# EAGLE schematic FrontboardTEST (EAGLE 9.0.1)
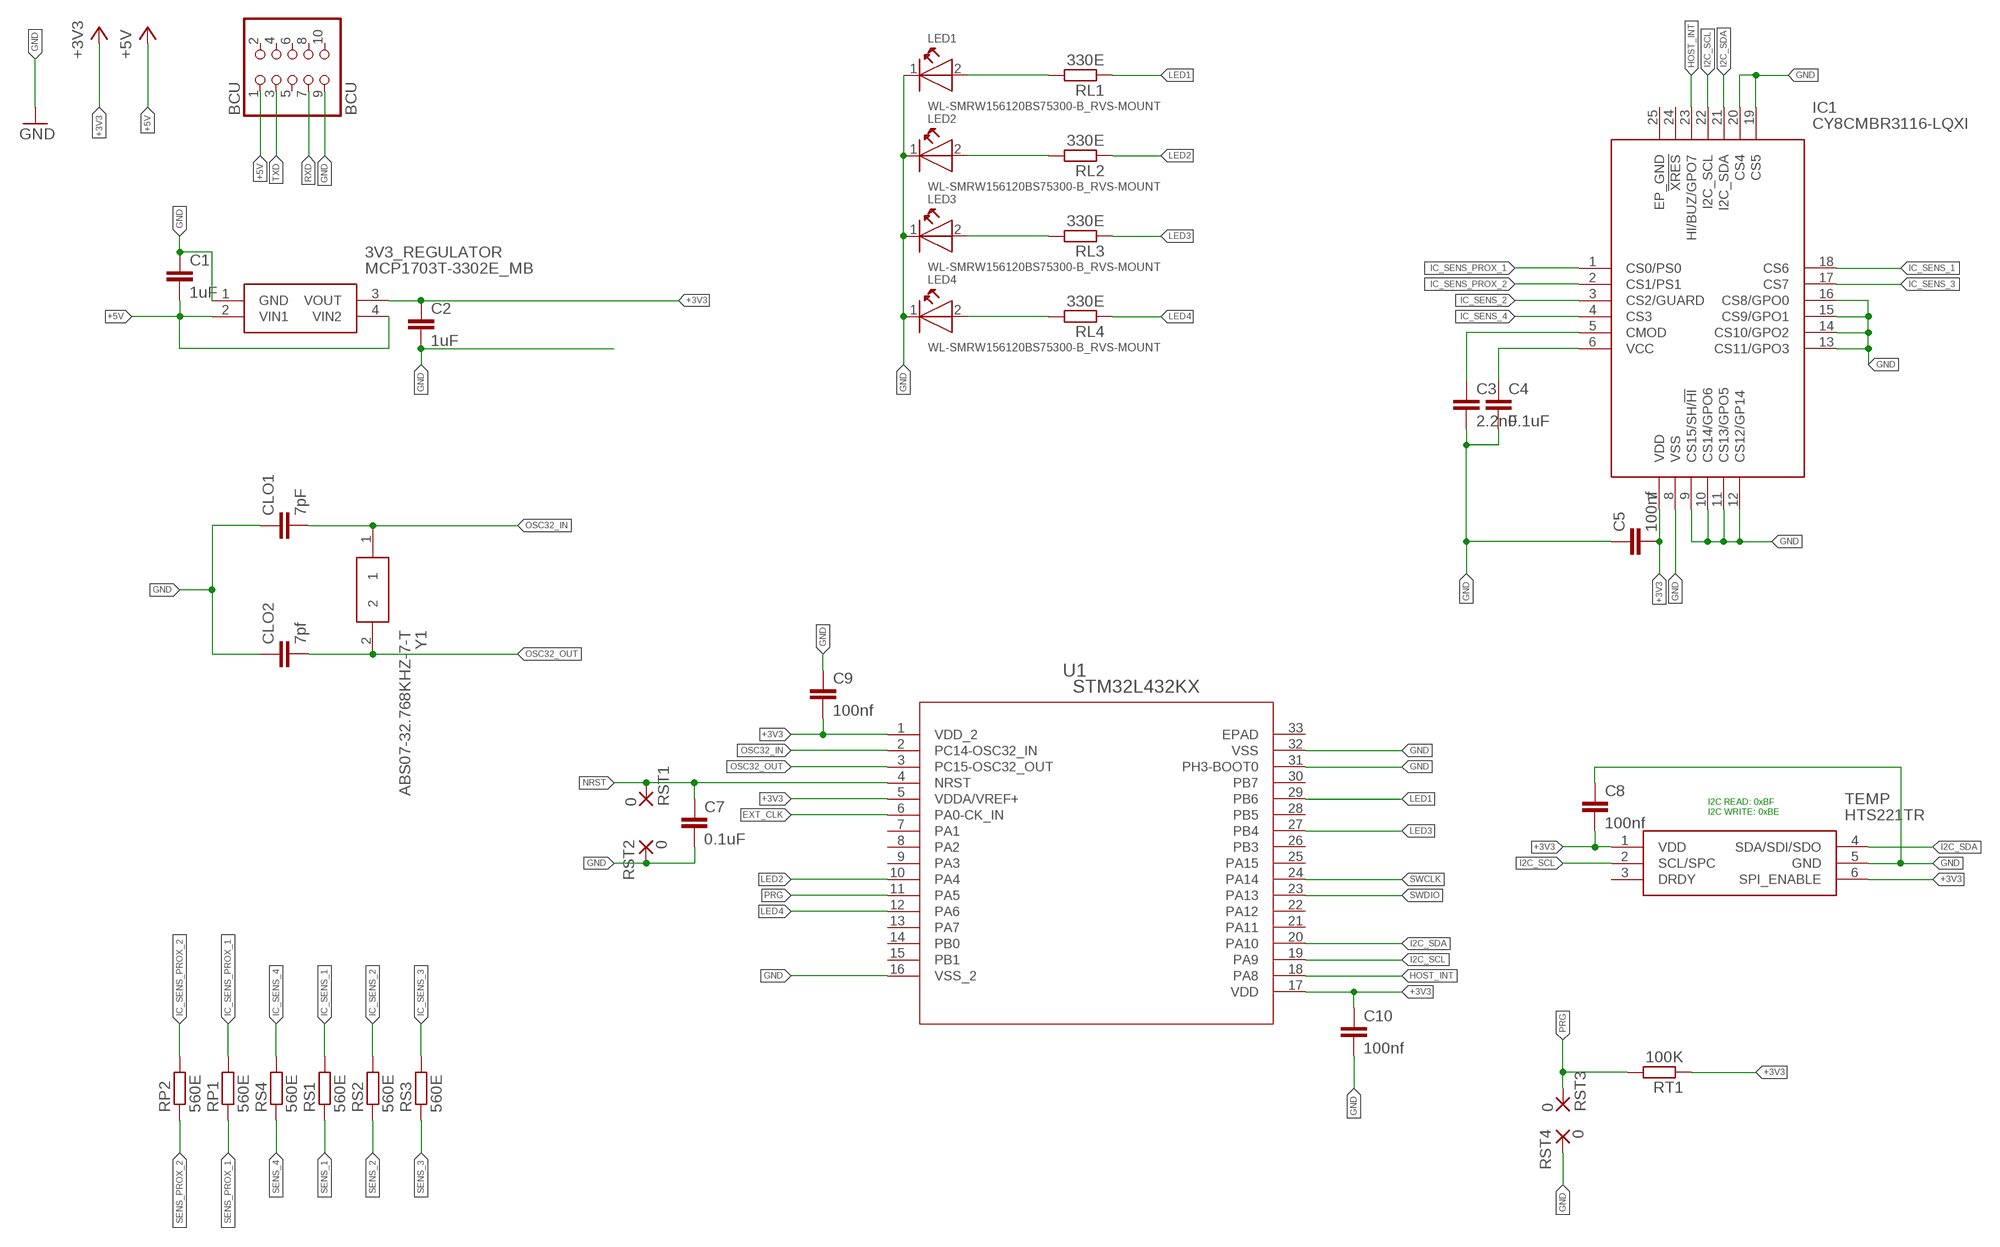
[diagram p0: schematic, sheet 1]

## Parts
3V3_REGULATOR  MCP1703T-3302E_MB  [SOT-89(MB)]
BCU  BCU  PINHD-2X5_2.54-SMD  [2X05SMD]
C1  1uF  C-EUC0603  [C0603]
C2  1uF  C-EUC0603  [C0603]
C3  2.2nF  C-EUC0603  [C0603]
C4  0.1uF  C-EUC0603  [C0603]
C5  100nf  C-EUC0603  [C0603]
C7  0.1uF  C-EUC0603  [C0603]
C8  100nf  C-EUC0603  [C0603]
C9  100nf  C-EUC0603  [C0603]
C10  100nf  C-EUC0603  [C0603]
CLO1  7pF  C-EUC0603  [C0603]
CLO2  7pf  C-EUC0603  [C0603]
IC1  CY8CMBR3116-LQXI  [QFN50P400X400X60-25N]
LED1  WL-SMRW156120BS75300-B_RVS-MOUNT  [WL-SMRW-1206-CYLDR-REVERSE-MOUNT]
LED2  WL-SMRW156120BS75300-B_RVS-MOUNT  [WL-SMRW-1206-CYLDR-REVERSE-MOUNT]
LED3  WL-SMRW156120BS75300-B_RVS-MOUNT  [WL-SMRW-1206-CYLDR-REVERSE-MOUNT]
LED4  WL-SMRW156120BS75300-B_RVS-MOUNT  [WL-SMRW-1206-CYLDR-REVERSE-MOUNT]
RL1  330E  R-EU_R0603  [R0603]
RL2  330E  R-EU_R0603  [R0603]
RL3  330E  R-EU_R0603  [R0603]
RL4  330E  R-EU_R0603  [R0603]
RP1  560E  R-EU_R0603  [R0603]
RP2  560E  R-EU_R0603  [R0603]
RS1  560E  R-EU_R0603  [R0603]
RS2  560E  R-EU_R0603  [R0603]
RS3  560E  R-EU_R0603  [R0603]
RS4  560E  R-EU_R0603  [R0603]
RST1  0  SMD5  [SMD2,54-5,08]
RST2  0  SMD5  [SMD2,54-5,08]
RST3  0  SMD5  [SMD2,54-5,08]
RST4  0  SMD5  [SMD2,54-5,08]
RT1  100K  R-EU_R0603  [R0603]
TEMP  HTS221TR  [HLGA-6L]
U1  STM32L432KX  [UFQFPN32-5X5MM]
Y1  ABS07-32.768KHZ-7-T  [ABS-07]

## Nets
+3V3: 3V3_REGULATOR.3(VOUT) C2.1 C5.2 C8.2 C9.2 C10.1 IC1.7(VDD) RT1.1 TEMP.1(VDD) TEMP.6(SPI_ENABLE) U1.1(VDD_2) U1.5(VDDA/VREF+) U1.17(VDD)
+5V: 3V3_REGULATOR.2(VIN1) 3V3_REGULATOR.4(VIN2) BCU.1 C1.2
CMOD: C3.1 IC1.5(CMOD)
EXT_CLK: U1.6(PA0-CK_IN)
GND: 3V3_REGULATOR.1(GND) BCU.9 C1.1 C2.2 C3.2 C4.2 C5.1 C7.2 C8.1 C9.1 C10.2 CLO1.1 CLO2.1 IC1.8(VSS) IC1.9(CS15/SH/!HI) IC1.10(CS14/GPO6) IC1.11(CS13/GPO5) IC1.12(CS12/GP14) IC1.13(CS11/GPO3) IC1.14(CS10/GPO2) IC1.15(CS9/GPO1) IC1.16(CS8/GPO0) IC1.19(CS5) IC1.20(CS4) LED1.1(K) LED2.1(K) LED3.1(K) LED4.1(K) RST2.1(P) RST4.1(P) TEMP.5(GND) U1.16(VSS_2) U1.31(PH3-BOOT0) U1.32(VSS)
HOST_INT: IC1.23(HI/BUZ/GPO7) U1.18(PA8)
I2C_SCL: IC1.22(I2C_SCL) TEMP.2(SCL/SPC) U1.19(PA9)
I2C_SDA: IC1.21(I2C_SDA) TEMP.4(SDA/SDI/SDO) U1.20(PA10)
IC_SENS_1: IC1.18(CS6) RS1.2
IC_SENS_2: IC1.3(CS2/GUARD) RS2.2
IC_SENS_3: IC1.17(CS7) RS3.2
IC_SENS_4: IC1.4(CS3) RS4.2
IC_SENS_PROX_1: IC1.1(CS0/PS0) RP1.2
IC_SENS_PROX_2: IC1.2(CS1/PS1) RP2.2
LED1: RL1.1 U1.29(PB6)
LED2: RL2.1 U1.10(PA4)
LED3: RL3.1 U1.27(PB4)
LED4: RL4.1 U1.12(PA6)
N$19: LED1.2(A) RL1.2
N$20: LED2.2(A) RL2.2
N$21: LED3.2(A) RL3.2
N$22: LED4.2(A) RL4.2
NRST: C7.1 RST1.1(P) U1.4(NRST)
OSC32_IN: CLO1.2 U1.2(PC14-OSC32_IN) Y1.1
OSC32_OUT: CLO2.2 U1.3(PC15-OSC32_OUT) Y1.2
PRG: RST3.1(P) RT1.2 U1.11(PA5)
RXD: BCU.7
SENS_1: RS1.1
SENS_2: RS2.1
SENS_3: RS3.1
SENS_4: RS4.1
SENS_PROX_1: RP1.1
SENS_PROX_2: RP2.1
SWCLK: U1.24(PA14)
SWDIO: U1.23(PA13)
TXD: BCU.3
VCC: C4.1 IC1.6(VCC)
Unconnected: BCU.2 BCU.4 BCU.5 BCU.6 BCU.8 BCU.10 IC1.24(!XRES) TEMP.3(DRDY) U1.7(PA1) U1.8(PA2) U1.9(PA3) U1.13(PA7) U1.14(PB0) U1.15(PB1) U1.21(PA11) U1.22(PA12) U1.25(PA15) U1.26(PB3) U1.28(PB5) U1.30(PB7) U1.33(EPAD)

## Notes on the sheet
- I2C READ: 0xBF
  I2C WRITE: 0xBE

## Power pins joined to a net without a drawn wire
EP_GND: IC1.25(EP_GND)

## Library data of the parts
3V3_REGULATOR = MCP1703T-3302E_MB:MCP1703T-3302E_MB: LDO Low Iq 250mA 16V 3.3V 2% SOT89 Microchip MCP1703T-3302E/MB, LDO Voltage Regulator, 250mA, 3.3 V 2%, 2.7 16 Vin, 3-Pin SOT-89 Source: Datasheet <http://ww1.microchip.com/downloads/en/DeviceDoc/22049f.pdf>; ALLIED_NUMBER: 70047986; ALLIED_PRICE/STOCK: https://www.alliedelec.com/microchip-technology-inc-mcp1703t-3302e-mb/70047986/; ARROW_PART_NUMBER: MCP1703T-3302E/MB; ARROW_PRICE/STOCK: https://www.arrow.com/en/products/mcp1703t-3302emb/microchip-technology; DESCRIPTION: LDO Low Iq 250mA 16V 3.3V 2% SOT89 Microchip MCP1703T-3302E/MB, LDO Voltage Regulator, 250mA, 3.3 V 2%, 2.7 16 Vin, 3-Pin SOT-89; HEIGHT: mm; MANUFACTURER_NAME: Microchip; MANUFACTURER_PART_NUMBER: MCP1703T-3302E/MB; RS_PART_NUMBER: 9122916; RS_PRICE/STOCK: http://uk.rs-online.com/web/p/products/9122916
BCU = pinhead:PINHD-2X5: PIN HEADER
C1-C5 C7-C10 CLO1 CLO2 = rcl:C-EU: CAPACITOR, European symbol; SPICEPREFIX: C
IC1 = CY8CMBR3116-LQXI:CY8CMBR3116-LQXI: Touch Screen Controllers CapSense Express 16 Buttons Source: Datasheet <http://www.cypress.com/file/46236/download.pdf>; ARROW_PART_NUMBER: CY8CMBR3116-LQXI; ARROW_PRICE/STOCK: https://www.arrow.com/en/products/cy8cmbr3116-lqxi/cypress-semiconductor; DESCRIPTION: Touch Screen Controllers CapSense Express 16 Buttons; HEIGHT: 0.6mm; MANUFACTURER_NAME: Cypress Semiconductor; MANUFACTURER_PART_NUMBER: CY8CMBR3116-LQXI; RS_PART_NUMBER: 1242976P; RS_PRICE/STOCK: http://uk.rs-online.com/web/p/products/1242976P
LED1-LED4 = Wurth_Elektronik_Optoelectronics_rev15b (1):WL-SMRW: SMD Reverse mount mono-color rectangular Characteristics Small size & thin body for space saving Ideal for narrow space applications Wide viewing angle Low power consumption Industry standard footprint Small package for exceptional brightness To emit light through a small cut-out hole in PCB Compatible with automatic placement machine Applications Front panel indicators LCD backlighting Keypad backlighting Push button backlighting Symbol and switch backlighting General lighting <http://katalog.we-online.de/media/images/eipal/WL-SMRW_pf2.jpg> Details see: http://katalog.we-online.de/en/led/WL-SMRW?m Updated 2015-04-10 2015 (C) Wurth Elektronik
RL1-RL4 RP1 RP2 RS1-RS4 RT1 = rcl:R-EU_: RESISTOR, European symbol; SPICEPREFIX: R
RST1-RST4 = wirepad:SMD5: SMD PAD
TEMP = HTS221TR:HTS221TR: Humidity and Temperature Sensor HLGA6 STMicroelectronics HTS221TR Temperature & Humidity Sensor, -40 +120 C, 6-Pin HLGA Source: Datasheet <http://www.st.com/content/ccc/resource/technical/document/datasheet/4d/9a/9c/ad/25/07/42/34/DM00116291.pdf/files/DM00116291.pdf/jcr:content/translations/en.DM00116291.pdf>; ARROW_PART_NUMBER: HTS221TR; ARROW_PRICE/STOCK: https://www.arrow.com/en/products/hts221tr/stmicroelectronics; DESCRIPTION: Humidity and Temperature Sensor HLGA6 STMicroelectronics HTS221TR Temperature & Humidity Sensor, -40 +120 C, 6-Pin HLGA; HEIGHT: mm; MANUFACTURER_NAME: STMicroelectronics; MANUFACTURER_PART_NUMBER: HTS221TR; RS_PART_NUMBER: 1660935; RS_PRICE/STOCK: http://uk.rs-online.com/web/p/products/1660935
U1 = STM32L432KC:STM32L432KX; MANUFACTURER_PART_NUMBER: stm32l432kx; VENDOR: ST Microelectronics
Y1 = ABS07-32.768KHZ-7-T:ABS07-32.768KHZ-7-T: ABRACON - ABS07-32.768KHZ-7-T - CRYSTAL, 32.768KHZ, 7PF, SMD Source: Datasheet <https://componentsearchengine.com/Datasheets/2/ABS07-32.768KHZ-7-T.pdf>; ARROW_PART_NUMBER: ABS07-32.768KHZ-7-T; ARROW_PRICE/STOCK: https://www.arrow.com/en/products/abs07-32.768khz-7-t/abracon; DESCRIPTION: ABRACON - ABS07-32.768KHZ-7-T - CRYSTAL, 32.768KHZ, 7PF, SMD; HEIGHT: mm; MANUFACTURER_NAME: ABRACON; MANUFACTURER_PART_NUMBER: ABS07-32.768KHZ-7-T; RS_PART_NUMBER: 1712773P; RS_PRICE/STOCK: http://uk.rs-online.com/web/p/products/1712773P